# EAGLE design STorM32 Micro Motor v252E micro (EAGLE 7.5.0)
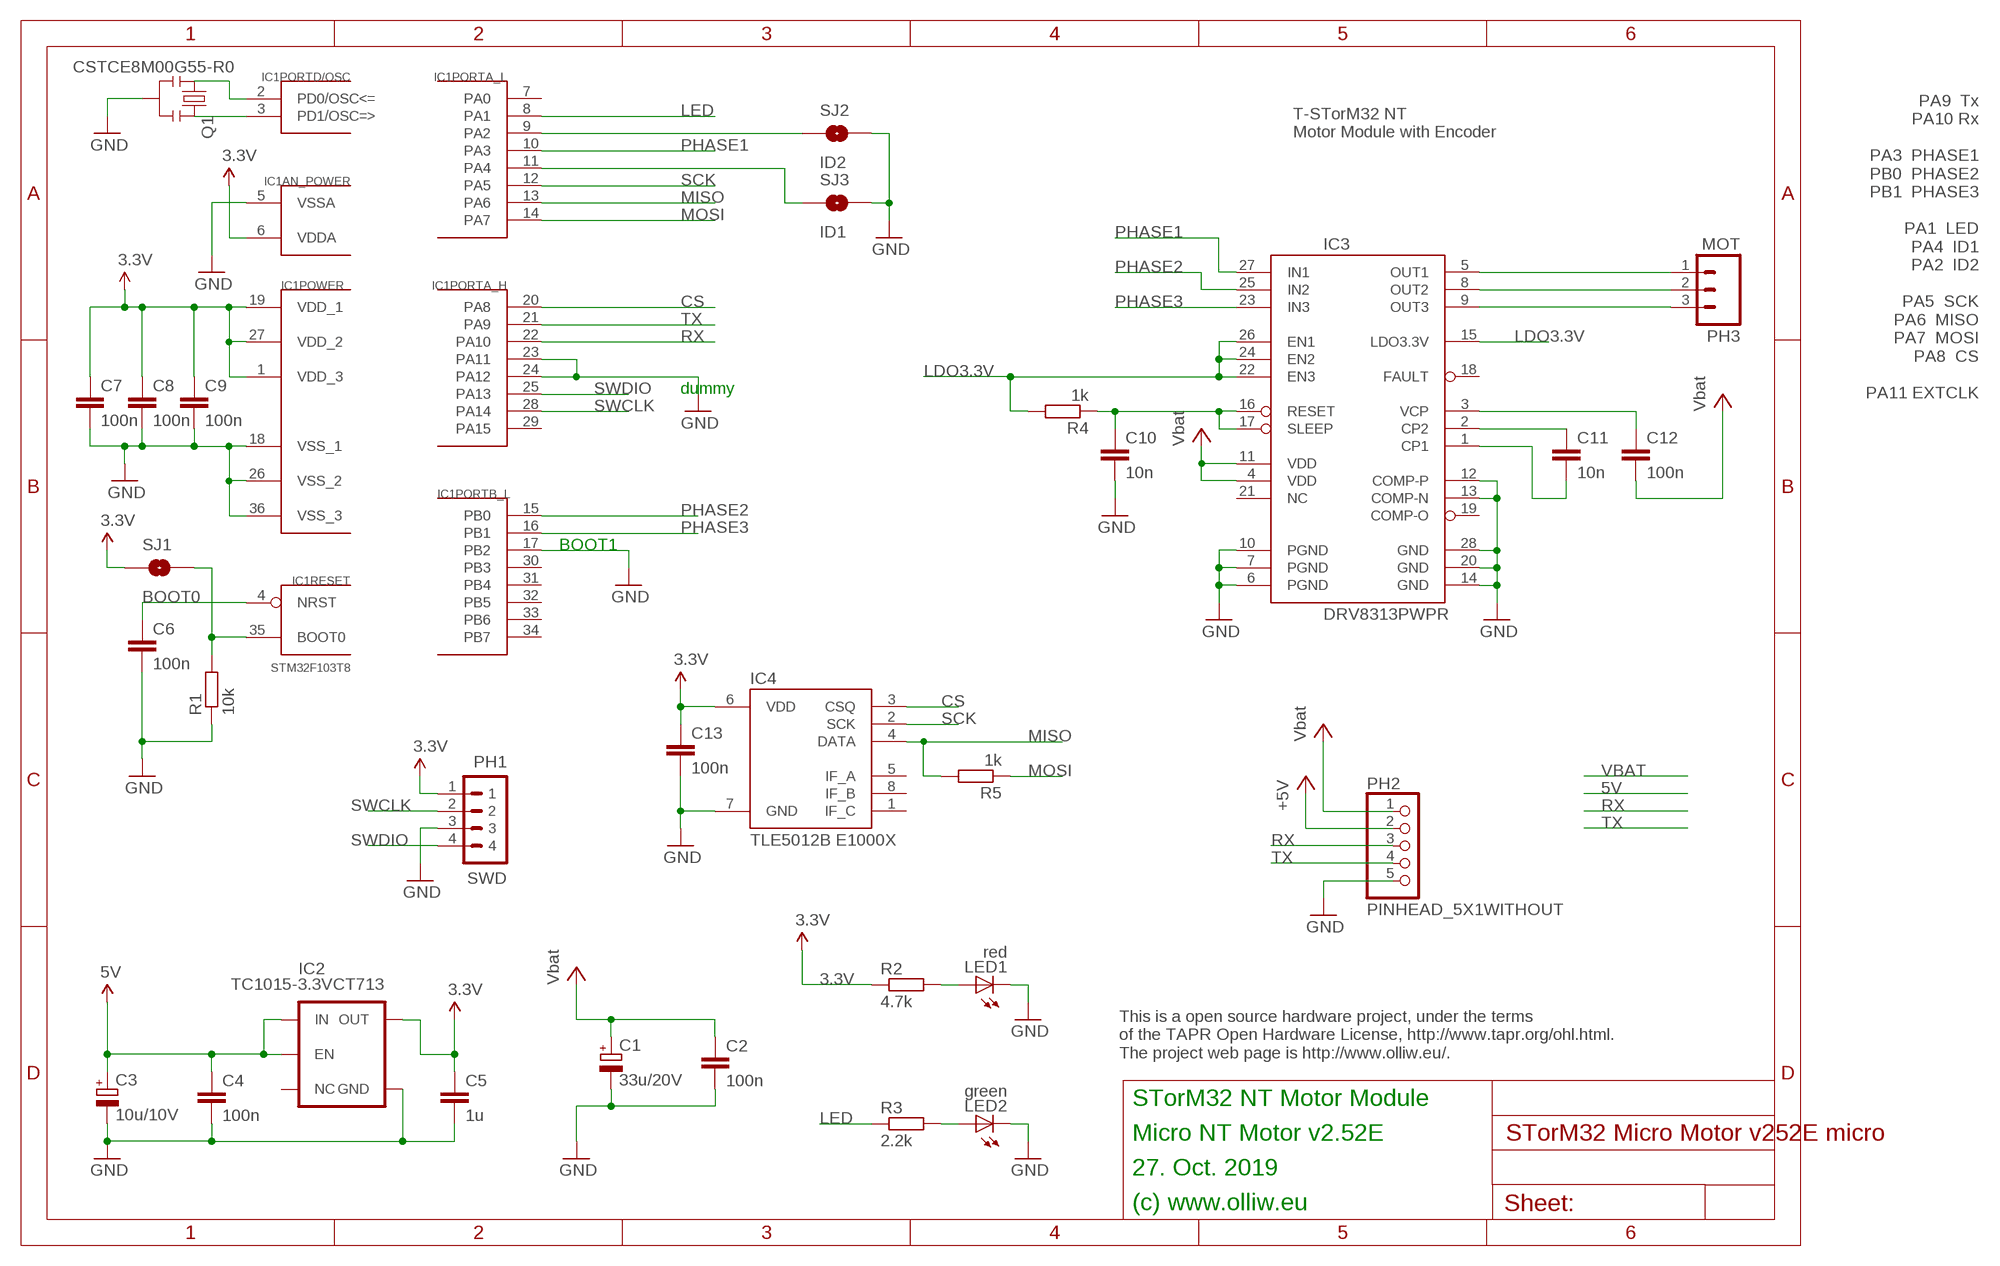
[diagram p0: schematic, sheet 1]

## Parts
C1  33u/20V  CPOL-EUSMCC  [SMC_C]
C2  100n  C-EUC0603  [C0603]
C3  10u/10V  CPOL-EUSMCB  [SMC_B]
C4  100n  C-EUC0603  [C0603]
C5  1u  C-EUC0603  [C0603]
C6  100n  C-EUC0402  [C0402]
C7  100n  C-EUC0402  [C0402]
C8  100n  C-EUC0402  [C0402]
C9  100n  C-EUC0402  [C0402]
C10  10n  C-EUC0402  [C0402]
C11  10n  C-EUC0603  [C0603]
C12  100n  C-EUC0603  [C0603]
C13  100n  C-EUC0402  [C0402]
IC1  STM32F103T8  STM32F10XTXU6  [VFQFPN36]
IC2  TC1015-3.3VCT713  V_REG_TPS76433SOT23-5  [SOT23-5]
IC3  DRV8313PWPR  DRV8313  [HTSSOP28]
IC4  TLE5012B E1000X  TLE5012B  [SO08]
LED1  red  LEDCHIPLED_0603  [CHIPLED_0603]
LED2  green  LEDCHIPLED_0603  [CHIPLED_0603]
PH1  SWD  P4X1_1P27-OCT_BILEX  [4X1_1P27_OCT_BILEX]
PH2  PINHEAD_5X1WITHOUT  [PINHEAD_5X1_WO]
PH3  MOT  M031X03_NO_SILK  [1X03_NO_SILK]
Q1  CSTCE8M00G55-R0  RESONATORSMD  [RESONATOR-SMD]
R1  10k  R-EU_R0402  [R0402]
R2  4.7k  R-EU_R0402  [R0402]
R3  2.2k  R-EU_R0402  [R0402]
R4  1k  R-EU_R0402  [R0402]
R5  1k  R-EU_R0402  [R0402]
SJ1  BOOT0  SOLDERJUMPERNO  [SJ_2S-NO]
SJ2  ID2  SOLDERJUMPERNO  [SJ_2S-NO]
SJ3  ID1  SOLDERJUMPERNO  [SJ_2S-NO]

## Nets
3.3V: C5.1 C7.1 C8.1 C9.1 C13.1 IC1.1(POWER:VDD_3) IC1.6(AN_POWER:VDDA) IC1.19(POWER:VDD_1) IC1.27(POWER:VDD_2) IC2.5(OUT) IC4.6(VDD) PH1.1 R2.1 SJ1.1
5V: C3.+ C4.1 IC2.1(IN) IC2.3(EN) PH2.2 ; supply symbol labelled +5V
CS: IC1.20(PORTA_H:PA8) IC4.3(CSQ)
GND: C1.- C2.2 C3.- C4.2 C5.2 C6.2 C7.2 C8.2 C9.2 C10.2 C13.2 IC1.5(AN_POWER:VSSA) IC1.17(PORTB_L:PB2) IC1.18(POWER:VSS_1) IC1.23(PORTA_H:PA11) IC1.24(PORTA_H:PA12) IC1.26(POWER:VSS_2) IC1.36(POWER:VSS_3) IC2.2(GND) IC3.6(PGND) IC3.7(PGND) IC3.10(PGND) IC3.12(COMP-P) IC3.13(COMP-N) IC3.14(GND) IC3.20(GND) IC3.28(GND) IC4.7(GND) LED1.C LED2.C PH1.3 PH2.5 Q1.2 R1.1 SJ2.2 SJ3.2
LDO3.3V: IC3.15(LDO3.3V) IC3.22(EN3) IC3.24(EN2) IC3.26(EN1) R4.2
LED: IC1.8(PORTA_L:PA1) R3.1
M1: IC3.5(OUT1) PH3.1
M2: IC3.8(OUT2) PH3.2
M3: IC3.9(OUT3) PH3.3
MISO: IC1.13(PORTA_L:PA6) IC4.4(DATA) R5.2
MOSI: IC1.14(PORTA_L:PA7) R5.1
N$3: IC1.9(PORTA_L:PA2) SJ2.1
N$5: IC1.11(PORTA_L:PA4) SJ3.1
N$7: C6.1 IC1.4(RESET:NRST)
N$8: IC1.35(RESET:BOOT0) R1.2 SJ1.2
N$9: IC1.2(PORTD/OSC:PD0/OSC<=) Q1.1
N$10: IC1.3(PORTD/OSC:PD1/OSC=>) Q1.3
N$11: LED1.A R2.2
N$12: LED2.A R3.2
N$16: C11.1 IC3.2(CP2)
N$18: C11.2 IC3.1(CP1)
N$19: C10.1 IC3.16(RESET) IC3.17(SLEEP) R4.1
N$20: C12.1 IC3.3(VCP)
PHASE1: IC1.10(PORTA_L:PA3) IC3.27(IN1)
PHASE2: IC1.15(PORTB_L:PB0) IC3.25(IN2)
PHASE3: IC1.16(PORTB_L:PB1) IC3.23(IN3)
RX: IC1.22(PORTA_H:PA10) PH2.3
SCK: IC1.12(PORTA_L:PA5) IC4.2(SCK)
SWCLK: IC1.28(PORTA_H:PA14) PH1.2
SWDIO: IC1.25(PORTA_H:PA13) PH1.4
TX: IC1.21(PORTA_H:PA9) PH2.4
VBAT: C1.+ C2.1 C12.2 IC3.4(VDD) IC3.11(VDD) PH2.1 ; supply symbol labelled Vbat
Unconnected: IC1.7(PORTA_L:PA0) IC1.29(PORTA_H:PA15) IC1.30(PORTB_L:PB3) IC1.31(PORTB_L:PB4) IC1.32(PORTB_L:PB5) IC1.33(PORTB_L:PB6) IC1.34(PORTB_L:PB7) IC2.4(NC) IC3.18(FAULT) IC3.19(COMP-O) IC3.21(NC) IC4.1(IF_C) IC4.5(IF_A) IC4.8(IF_B)

## Notes on the sheet
- PA9  Tx
  PA10 Rx
  
  PA3  PHASE1
  PB0  PHASE2
  PB1  PHASE3
  
  PA1  LED
  PA4  ID1
  PA2  ID2
  
  PA5  SCK
  PA6  MISO
  PA7  MOSI
  PA8  CS
  
  PA11 EXTCLK
- T-STorM32 NT
  Motor Module with Encoder
- dummy
- BOOT1
- This is a open source hardware project, under the terms
  of the TAPR Open Hardware License, http://www.tapr.org/ohl.html.
  The project web page is http://www.olliw.eu/.
- STorM32 NT Motor Module
- Micro NT Motor v2.52E
- 27. Oct. 2019
- (c) www.olliw.eu

## Library data of the parts
C1 C3 = rcl:CPOL-EU: POLARIZED CAPACITOR, European symbol
C2 C4 C5 C11 C12 = rcl:C-EU: CAPACITOR, European symbol
C6-C10 C13 = # rcl:C-EU: CAPACITOR, European symbol
IC1 = # stm32:STM32F10XTXU6: STM32F101/103 36pad VFQPFN36
IC2 = # SparkFun2:V_REG_TPS76433: Voltage Regulator Older TI part. LDO 150mA regulator. No output by-pass cap option. See V_REG_LDO for a better part.
IC3 = # stdlib:DRV8313
IC4 = # stdlib:TLE5012B
LED1 LED2 = led:LED: LED OSRAM: - CHIPLED LG R971, LG N971, LY N971, LG Q971, LY Q971, LO R971, LY R971 LH N974, LH R974 LS Q976, LO Q976, LY Q976 LO Q996 - Hyper CHIPLED LW Q18S LB Q993, LB Q99A, LB R99A - SideLED LS A670, LO A670, LY A670, LG A670, LP A670 LB A673, LV A673, LT A673, LW A673 LH A674 LY A675 LS A676, LA A676, LO A676, LY A676, LW A676 LS A679, LY A679, LG A679 - Hyper Micro SIDELED® LS Y876, LA Y876, LO Y876, LY Y876 LT Y87S - SmartLED LW L88C, LW L88S LB L89C, LB L89S, LG L890 LS L89K, LO L89K, LY L89K LS L896, LA L896, LO L896, LY L896 - TOPLED LS T670, LO T670, LY T670, LG T670, LP T670 LSG T670, LSP T670, LSY T670, LOP T670, LYG T670 LG T671, LOG T671, LSG T671 LB T673, LV T673, LT T673, LW T673 LH T674 LS T676, LA T676, LO T676, LY T676, LB T676, LH T676, LSB T676, LW T676 LB T67C, LV T67C, LT T67C, LS T67K, LO T67K, LY T67K, LW E67C LS E67B, LA E67B, LO E67B, LY E67B, LB E67C, LV E67C, LT E67C LW T67C LS T679, LY T679, LG T679 LS T770, LO T770, LY T770, LG T770, LP T770 LB T773, LV T773, LT T773, LW T773 LH T774 LS E675, LA E675, LY E675, LS T675 LS T776, LA T776, LO T776, LY T776, LB T776 LHGB T686 LT T68C, LB T68C - Hyper Mini TOPLED® LB M676 - Mini TOPLED Santana® LG M470 LS M47K, LO M47K, LY M47K Source: http://www.osram.convergy.de LUXEON: - LUMILED® LXK2-PW12-R00, LXK2-PW12-S00, LXK2-PW14-U00, LXK2-PW14-V00 LXK2-PM12-R00, LXK2-PM12-S00, LXK2-PM14-U00 LXK2-PE12-Q00, LXK2-PE12-R00, LXK2-PE12-S00, LXK2-PE14-T00, LXK2-PE14-U00 LXK2-PB12-K00, LXK2-PB12-L00, LXK2-PB12-M00, LXK2-PB14-N00, LXK2-PB14-P00, LXK2-PB14-Q00 LXK2-PR12-L00, LXK2-PR12-M00, LXK2-PR14-Q00, LXK2-PR14-R00 LXK2-PD12-Q00, LXK2-PD12-R00, LXK2-PD12-S00 LXK2-PH12-R00, LXK2-PH12-S00 LXK2-PL12-P00, LXK2-PL12-Q00, LXK2-PL12-R00 Source: www.luxeon.com KINGBRIGHT: KA-3528ASYC Source: www.kingbright.com
PH1 = # stdlib:P4X1_1P27
PH2 = # stdlib:PINHEAD_5X1
PH3 = # SparkFun2:M03: Header 3 Standard 3-pin 0.1" header. Use with straight break away headers (SKU : PRT-00116), right angle break away headers (PRT-00553), swiss pins (PRT-00743), machine pins (PRT-00117), and female headers (PRT-00115). Molex polarized connector foot print use with SKU : PRT-08232 with associated crimp pins and housings.
Q1 = # SparkFun2:RESONATOR: Resonator Small SMD resonator. This is the itty bitty 10/20MHz resonators with built in caps. CSTCE10M0G55 and CSTCE20M0V53. Footprint has been reviewed closely but hasn't been tested yet.
R1-R5 = # rcl:R-EU_: RESISTOR, European symbol
SJ1-SJ3 = # SparkFun2:SOLDERJUMPER: Solder Jumper Standard SMD solder jumper. Used to automate production. Two varients : Normally Open and Normally Closed are the same, but have different paste layers. NC will have a large amount of paste and should jumper during reflow.

## Board
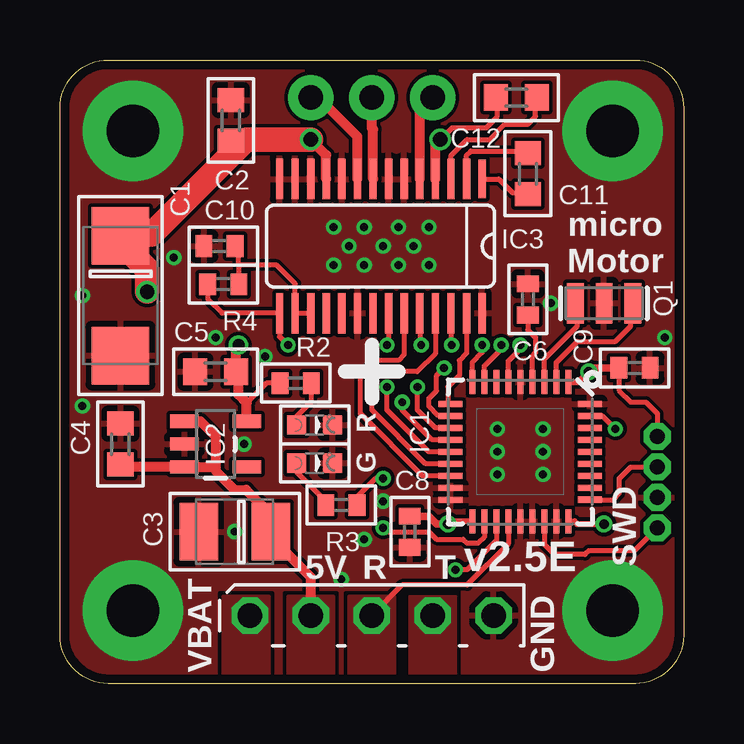
[diagram p1: board, top side]
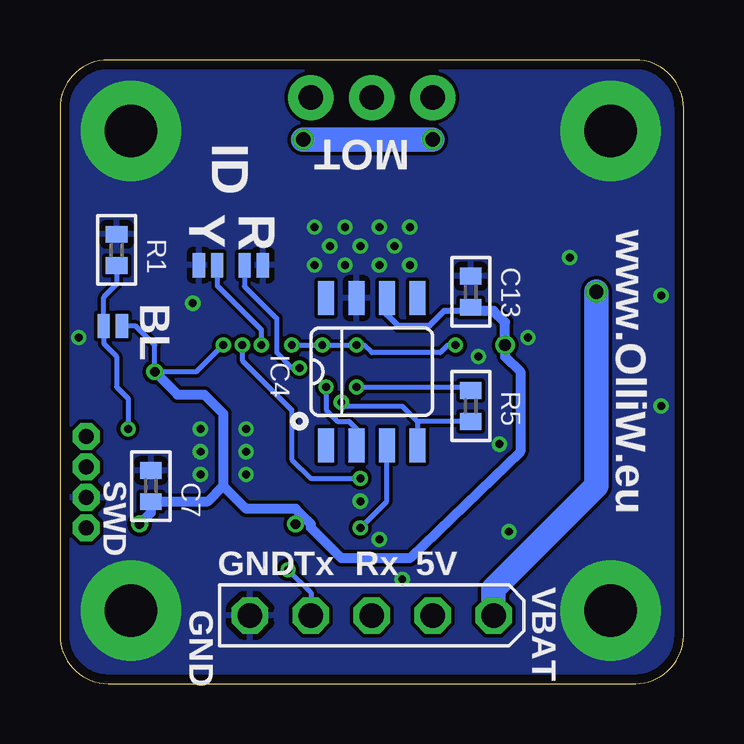
[diagram p2: board, bottom side, seen from below]

Size 26 x 26 mm. Coordinates in mm from the lower left corner, seen from the top.
Outline: 24,0 2,0 arc-90 0,2 0,24 arc-90 2,26 24,26 arc-90 26,24 26,2 arc-90 24,0
Copper layers (1*16): Top 0.035mm / dielectric 1.5mm / Bottom 0.035mm
Design rules "ShenZhen2U_2layer_EagleRules *": minimum track width 6mil, minimum drill 12mil, track to track 6mil, track to pad 6mil, pad to pad 6mil, via to via 6mil, smd to smd 0mil, copper to edge 15mil, drill to drill 10mil, minimum pad ring 10mil, minimum via ring 6mil, stop-mask expansion 2mil, vias tented up to drill 25mil, thermal gap 10mil

### Footprints (pad centres in the part's own frame; a part is rotated, then mirrored left to right if it is on the bottom)
SMC_C = smd 2.4 x 2.4: + -2.5,0; - 2.5,0
C0603 = smd 1 x 1.1: 1 -0.85,0; 2 0.85,0
SMC_B = smd 1.6 x 2.4: + -1.5,0; - 1.5,0
C0402 = smd 0.7 x 0.9: 1 -0.65,0; 2 0.65,0
VFQFPN36 = smd 1 x 0.25: 1 -2.9,2; 2 -2.9,1.5; 3 -2.9,1; 4 -2.9,0.5; 5 -2.9,0; 6 -2.9,-0.5; 7 -2.9,-1; 8 -2.9,-1.5; 9 -2.9,-2; 19 2.9,-2; 20 2.9,-1.5; 21 2.9,-1; 22 2.9,-0.5; 23 2.9,0; 24 2.9,0.5; 25 2.9,1; 26 2.9,1.5; 27 2.9,2 | smd 0.25 x 1: 10 -2,-2.9; 11 -1.5,-2.9; 12 -1,-2.9; 13 -0.5,-2.9; 14 0,-2.9; 15 0.5,-2.9; 16 1,-2.9; 17 1.5,-2.9; 18 2,-2.9; 29 1.5,2.9; 30 1,2.9; 31 0.5,2.9; 32 0,2.9; 33 -0.5,2.9; 34 -1,2.9; 35 -1.5,2.9; 36 -2,2.9 | smd 0.27 x 1: 28 2,2.9
SOT23-5 = smd 0.55 x 1.2: 1 -0.95,-1.3; 2 0,-1.3; 3 0.95,-1.3; 4 0.95,1.3; 5 -0.95,1.3
HTSSOP28 = smd 0.3 x 1.6: 1 0,-2.8 | smd 0.305 x 1.676: 2 0.65,-2.8; 3 1.3,-2.8; 4 1.95,-2.8; 5 2.6,-2.8; 6 3.25,-2.8; 7 3.9,-2.8; 8 4.55,-2.8; 9 5.2,-2.8; 10 5.85,-2.8; 11 6.5,-2.8; 12 7.15,-2.8; 13 7.8,-2.8; 14 8.45,-2.8; 15 8.45,2.8; 16 7.8,2.8; 17 7.15,2.8; 18 6.5,2.8; 19 5.85,2.8; 20 5.2,2.8; 21 4.55,2.8; 22 3.9,2.8; 23 3.25,2.8; 24 2.6,2.8; 25 1.95,2.8; 26 1.3,2.8; 27 0.65,2.8; 28 0,2.8
SO08 = smd 0.66 x 1.397: 1 0,-3.073; 2 1.27,-3.073; 3 2.54,-3.073; 4 3.81,-3.073; 5 3.81,3.073; 6 2.54,3.073; 7 1.27,3.073; 8 0,3.073
CHIPLED_0603 = smd 0.8 x 0.8: A 0,-0.75; C 0,0.75
4X1_1P27_OCT_BILEX = drill 0.61 pad 1.118 octagon: 1 0,0; 2 0,-1.27; 3 0,-2.54; 4 0,-3.81
PINHEAD_5X1_WO = drill 1.016 octagon: 1 0,0; 2 0,-2.54; 3 0,-5.08; 4 0,-7.62; 5 0,-10.16
1X03_NO_SILK = drill 1.016 pad 1.88: 1 0,0; 2 2.54,0; 3 5.08,0
RESONATOR-SMD = smd 0.7 x 1.7: 1 -1.2,0; 2 0,0; 3 1.2,0
R0402 = smd 0.7 x 0.9: 1 -0.65,0; 2 0.65,0
SJ_2S-NO = smd 0.508 x 1.016: 1 -0.381,0; 2 0.381,0

### Placement (x,y rotation side)
C1  2.52,16.17 270 top
C2  7.13,23.48 90 top
C3  7.29,6.33 180 top
C4  2.52,9.98 90 top
C5  6.49,13 180 top
C6  19.51,16.02 90 top
C7  22.21,8.24 90 bottom
C8  14.59,6.33 270 top
C9  23.95,13.16 0 top
C10  6.65,18.24 180 top
C11  19.51,21.26 270 top
C12  19.03,24.43 180 top
C13  8.87,16.33 90 bottom
IC1  19.19,9.67 270 top
IC2  6.49,9.98 270 top
IC3  17.6,18.24 180 top
IC4  14.91,13 0 bottom
LED1  10.62,10.78 270 top
LED2  10.62,9.19 270 top
PH1  24.91,10.3 0 top
PH2  7.92,2.84 270 bottom
PH3  15.54,24.43 180 top
Q1  22.68,15.86 180 top
R1  23.64,18.08 270 bottom
R2  9.83,12.52 0 top
R3  11.73,7.44 180 top
R4  6.81,16.65 180 top
R5  8.87,11.57 270 bottom
SJ1  23.8,14.9 180 bottom
SJ2  19.83,17.45 180 bottom
SJ3  17.92,17.45 0 bottom

### Tracks (layer width: path | path; a pad name or v marks a point on that pad's centre or on a via)
3.3V  (via drill 0.33, 0.4, 0.5)
  Top 0.203: R2.1 8.62,12.52 7.79,11.7 | v19.19,14.11 19.19,13.95 18.69,13.45 IC1.6 | C9.1 23.3,12.22 23.8,11.73 24.43,11.73 24.91,11.25 PH1.1 | 14.6,6.97 C8.1
  Top 0.254: IC1.19 16.29,6.77 v16.18,6.65 | v22.05,13 21.62,12.57 IC1.1 | IC1.27 21.46,6.77 21.57,6.65 v22.68,6.65
  Top 0.305: C9.1 22.21,13.16 v22.05,13 | v16.18,6.65 15.7,6.65 15.38,6.97 14.6,6.97
  Top 0.406: IC2.5 7.79,11.7 7.44,12.05 7.44,12.9 C5.1 7.34,14.01 v7.44,14.11
  Bottom 0.203: v19.19,14.11 20.3,13 v22.05,13 22.05,14.11 22.84,14.9 SJ1.1
  Bottom 0.254: C13.1 8.89,15.54 9.98,15.54 10.62,14.9 11.89,14.9 12.37,15.38 IC4.6
  Bottom 0.406: C13.1 8.86,15.54 7.92,15.54 7.44,15.06 v7.44,14.11 7.44,13.63 6.81,13 6.81,9.67 11.41,5.22 14.27,5.22 15.54,6.49 15.54,6.65 15.86,6.97 | 15.86,6.97 16.18,7.29 18.24,7.29 19.19,8.24 | v22.05,13 21.1,12.05 19.98,12.05 19.19,11.25 19.19,8.24 | v16.18,6.65 15.86,6.97 | v22.68,6.65 22.21,7.13 C7.1 22.06,7.59 21.89,7.6 19.83,7.6 19.19,8.24
5V
  Top 0.406: PH2.2 10.46,4.43 9.19,5.7 9.19,6.09 C3.+ 8.87,6.4 8.71,7.13 7.76,8.08 7.29,8.08 6.49,8.87 6.49,9.03 | IC2.1 5.86,10.93 6.49,10.3 6.49,9.03 | 6.49,9.03 6.33,9.03 IC2.3 2.62,9.03 C4.1
  pour Top (isolate 0.305, no thermals): 9.51,0.14 9.51,3.63 11.41,3.63 11.41,0.14
CS  (via drill 0.33)
  Top 0.203: IC1.20 17.69,6.1 17.45,5.86 16.97,5.86 16.81,6.02 15.7,6.02 15.38,6.33 13.64,6.33 v13.48,6.49
  Bottom 0.203: v13.48,6.49 12.37,7.6 IC4.3
GND  (via drill 0.33, 2.2 pad 4.2)
  other vias: 3.04,3.04 23.04,3.04 3.04,23.04 23.04,23.04 4.75,17.76 11.41,19.03 11.41,17.45 15.38,17.45 15.38,19.03 12.68,17.45 14.11,17.45 12.68,19.03 14.11,19.03 12.05,18.24 14.75,18.24 13.48,18.24 18.24,10.62 20.14,10.62 18.24,8.71 20.14,8.71 8.55,13.63 7.68,9.98 12.68,6.02 13.48,7.6 0.94,11.57 0.94,16.17 6.49,14.43 25.22,14.43 20.46,15.86 18.24,9.67 20.14,9.67 7.29,6.33 11.73,4.35
  pour Top (isolate 0.152, rank 6): -0.97,-0.97 -0.97,26.97 26.97,26.97 26.97,-0.97
  pour Bottom (isolate 0.152, rank 6): -0.34,-0.34 -0.34,26.34 26.34,26.34 26.34,-0.34
LDO3.3V  (via drill 0.33)
  Top 0.203: R4.2 6.17,16.64 6.17,16.02 6.75,15.44 IC3.15 9.15,14.46 v9.51,14.11 | IC3.22 13.7,14.2 v13.64,14.11 | IC3.24 15,14.17 v15.06,14.11 | IC3.26 16.3,14.14 v16.33,14.11
  Bottom 0.203: v9.51,14.11 9.83,14.11 10.14,13.79 13,13.79 13.32,14.11 v13.64,14.11 v15.06,14.11 v16.33,14.11
LED  (via drill 0.33)
  Top 0.203: IC1.8 17.69,13.25 18.4,13.95 v18.4,14.11 | R3.1 12.21,7.6 13.16,8.55 v13.48,8.55
  Bottom 0.203: v18.4,14.11 18.4,13.48 16.33,11.41 16.33,9.35 15.54,8.55 v13.48,8.55
M1
  Top 0.406: IC3.5 15,23.89 PH3.1
M2
  Top 0.406: IC3.8 13.05,23.11 13,23.16 PH3.2
M3
  Top 0.406: IC3.9 12.4,22.8 11.09,24.11 10.78,24.11 PH3.3
MISO  (via drill 0.33)
  Top 0.203: IC1.13 15.52,10.17 14.27,11.41 v14.27,11.73
  Bottom 0.203: v14.27,11.73 14.11,11.57 11.73,11.57 11.09,10.94 | 11.09,10.94 IC4.4 | R5.2 8.7,10.76 9.19,10.94 11.09,10.94
MOSI  (via drill 0.33)
  Top 0.203: IC1.14 15.38,9.67 13.64,11.41 v13.64,12.37
  Bottom 0.203: v13.64,12.37 8.86,12.37 R5.1
N$3  (via drill 0.33)
  Top 0.203: IC1.9 17.19,13.38 17.6,13.79 v17.6,14.11
  Bottom 0.203: v17.6,14.11 17.6,14.75 19.45,16.59 SJ2.1
N$5  (via drill 0.33)
  Top 0.203: IC1.11 15.79,11.17 15.38,11.57 15.38,11.89 15.7,12.21 15.7,12.84 v16.02,13.16
  Bottom 0.203: v16.02,13.16 16.33,13.16 16.97,13.79 16.97,15.22 18.3,16.56 SJ3.1
N$7
  Top 0.203: C6.1 19.51,14.75 19.83,14.43 19.83,13.79 19.69,13.66 IC1.4
N$8  (via drill 0.33)
  Top 0.203: IC1.35 22.61,11.17 v23.16,10.62
  Bottom 0.203: v23.16,10.62 23.16,11.89 23.64,12.37 23.64,13.63 24.18,14.17 SJ1.2 24.18,16.11 23.64,16.65 R1.2
N$9
  Top 0.203: IC1.2 20.69,13.39 21.57,14.27 23.16,14.27 23.8,14.9 23.8,15.61 Q1.1
N$10
  Top 0.203: IC1.3 20.19,13.52 21.57,14.9 21.57,15.95 Q1.3
N$11
  Top 0.203: R2.2 10.48,11.74 9.83,11.1 9.83,10.89 LED1.A
N$12
  Top 0.203: LED2.A 9.87,8.83 11.09,7.6 11.25,7.6 10.94,7.46 R3.2
N$16
  Top 0.203: IC3.2 16.95,22.03 17.13,22.21 19.29,22.21 C11.1
N$18
  Top 0.203: IC3.1 18.3,21.04 18.87,20.46 19.77,20.46 C11.2
N$19
  Top 0.203: 7.44,17.45 9.03,17.45 9.8,16.67 IC3.16 IC3.17 | 7.44,17.45 7.44,18.22 C10.1 | 7.44,17.45 7.44,16.67 R4.1
N$20
  Top 0.203: IC3.3 16.3,22.02 16.97,22.68 17.92,22.68 18.56,23.32 19.51,23.32 19.83,23.64 19.83,24.21 C12.1
PHASE1
  Top 0.203: IC3.27 16.95,13.78 16.65,13.48 16.65,12.84 16.18,12.37 16.18,11.67 IC1.10
PHASE2
  Top 0.203: IC1.15 15.25,9.17 13,11.41 13,12.68 13.32,13 14.91,13 15.65,13.75 IC3.25
PHASE3
  Top 0.203: IC1.16 15.11,8.67 12.52,11.25 12.52,12.84 13.16,13.48 14.11,13.48 14.35,13.72 IC3.23
RX
  Top 0.203: IC1.22 18.69,5.83 16.97,4.11 14.27,4.11 PH2.3
  pour Top (isolate 0.305, no thermals): 12.05,0.14 12.05,3.63 13.95,3.63 13.95,0.14
SCK  (via drill 0.33)
  Top 0.203: IC1.12 15.65,10.67 14.91,11.41 v14.91,12.37
  Bottom 0.203: IC4.2 13.64,10.62 13.95,10.94 14.43,10.94 14.91,11.41 v14.91,12.37
SWCLK
  Top 0.203: IC1.28 23.07,7.67 23.32,7.92 23.32,8.55 23.8,9.03 PH1.2
SWDIO
  Top 0.203: IC1.25 20.19,5.81 20.62,5.38 21.89,5.38 22.05,5.54 23.95,5.54 PH1.4
TX  (via drill 0.33)
  Top 0.203: IC1.21 18.19,5.97 16.97,4.75 v16.49,4.75
  Bottom 0.203: v16.49,4.75 15.54,3.79 PH2.4
  pour Top (isolate 0.305, no thermals): 14.59,0.14 14.59,3.63 16.49,3.63 16.49,0.14
VBAT  (via drill 0.6)
  Top 0.203: v15.86,22.68 16.33,23.16 17.76,23.16 18.24,23.64 18.24,24.17 C12.2 | 1.89,18.71 1.73,18.87 2.16,18.87 C1.+
  Top 0.254: C2.1 8.02,22.63 7.76,22.68
  Top 0.406: IC3.11 11.1,22.04 v10.46,22.68 | IC3.4 15.65,22.48 v15.86,22.68
  Top 0.813: 2.84,18.08 2.84,18.2 C1.+
  Top 1.016: v10.46,22.68 7.76,22.68 3.79,18.71 1.89,18.71 | v3.63,16.33 3.63,17.29 2.84,18.08
  Bottom 1.016: v10.46,22.68 v15.86,22.68 | PH2.1 7.92,3.95 3.63,8.24 v3.63,16.33
  pour Top (isolate 0.305, no thermals): 6.81,0.14 6.81,3.63 8.71,3.63 8.71,0.14

### Text on the board
tNames: micro / Motor | R | G | SWD | 5V | R | T | v2.5E | VBAT | GND
bNames: MOT | ID | R | Y | BL | www.OlliW.eu | SWD | 5V | Rx | Tx | GND | VBAT | GND